# EAGLE design ESP32S2 STICK (EAGLE 9.6.2)
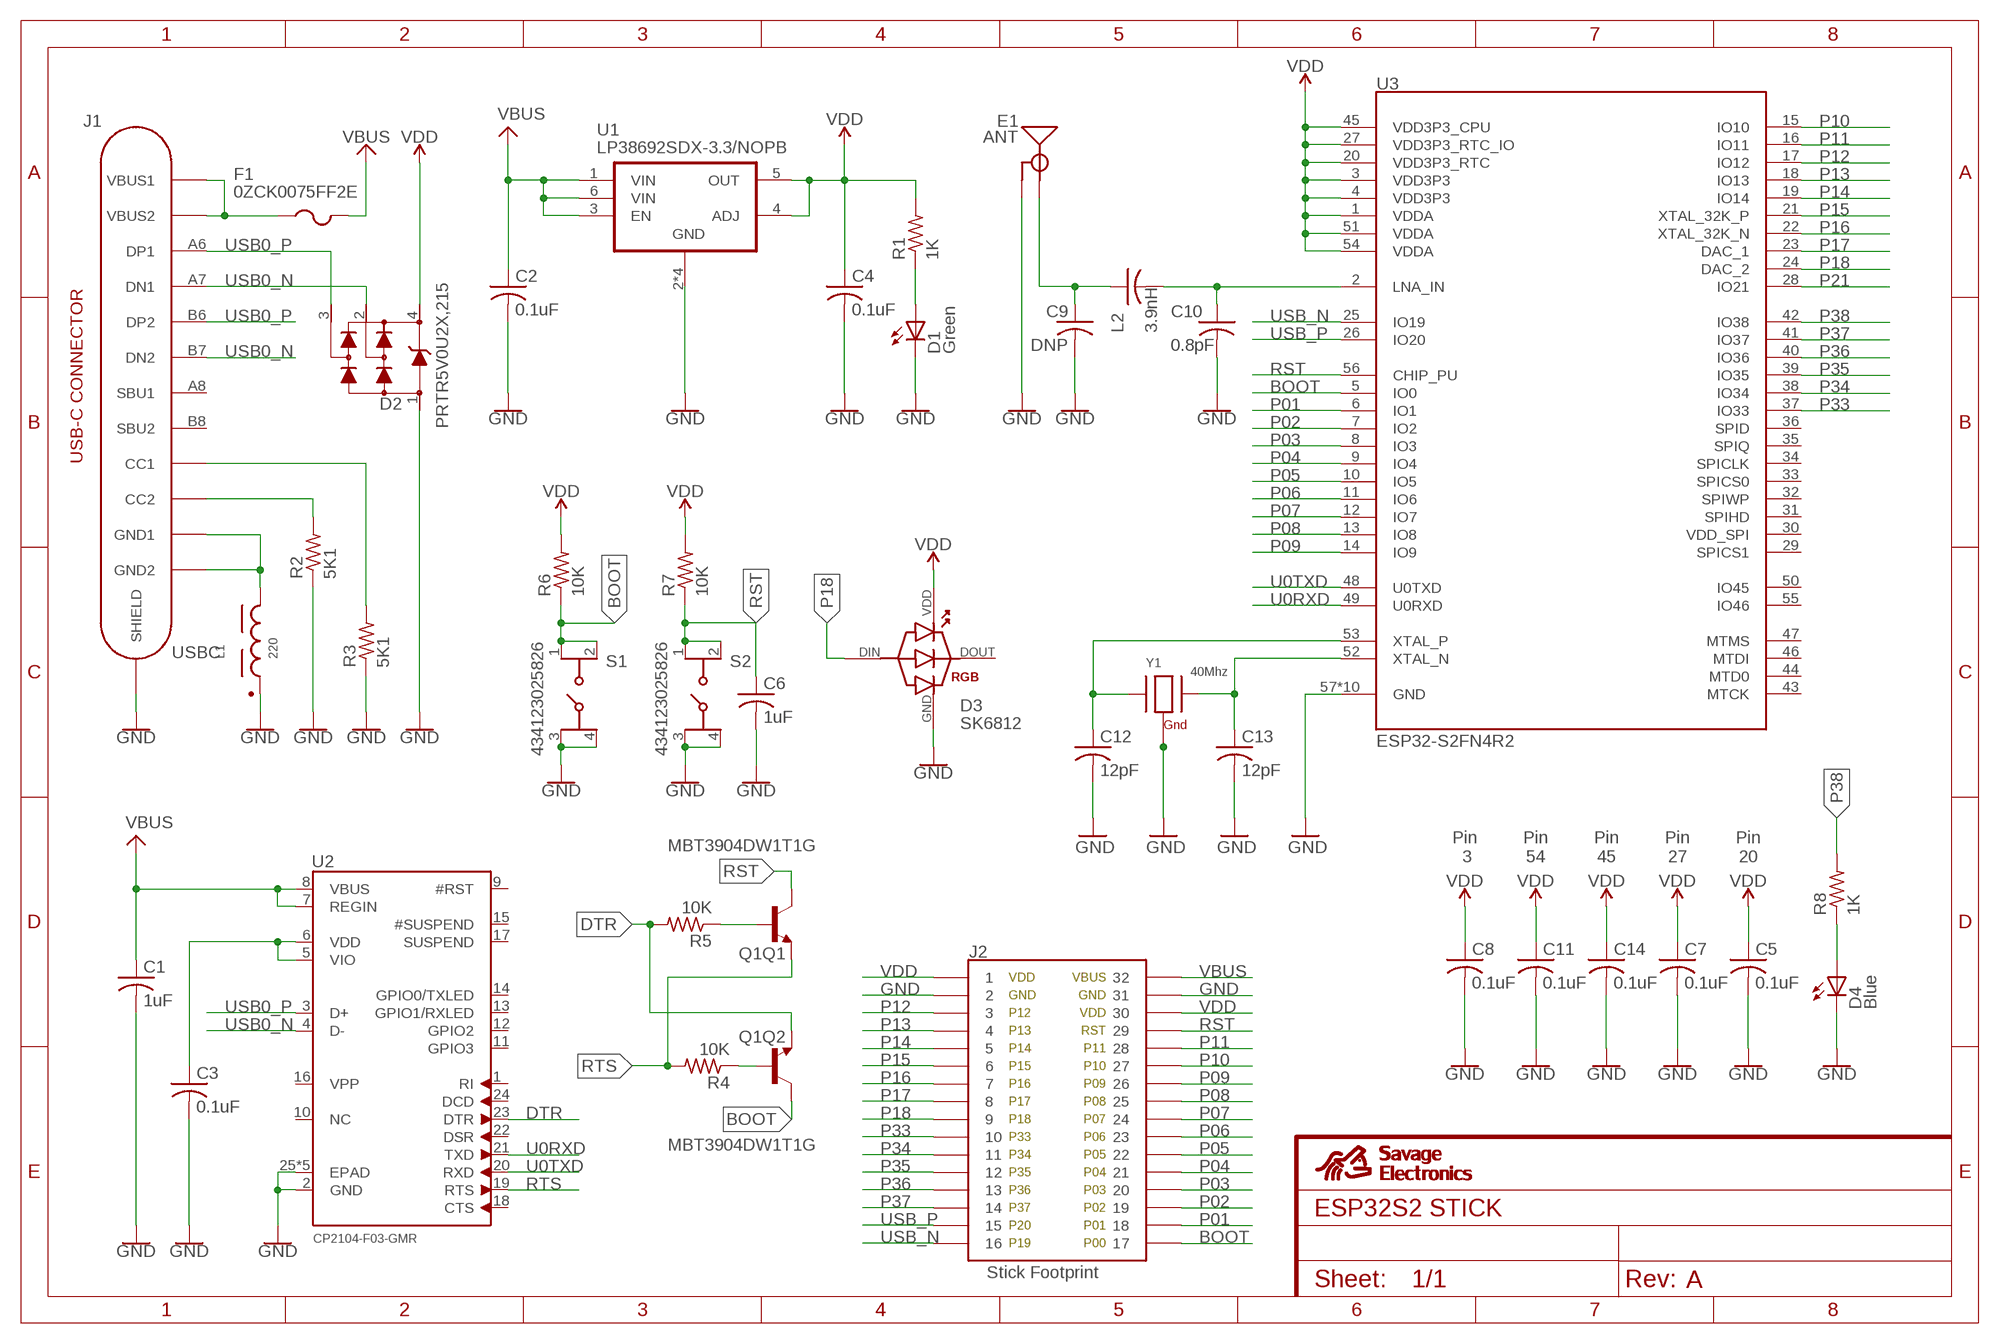
[diagram p0: schematic, sheet 1]

## Parts
C1  1uF  C-USC0603  [C0603]
C2  0.1uF  C-USC0603  [C0603]
C3  0.1uF  C-USC0603  [C0603]
C4  0.1uF  C-USC0603  [C0603]
C5  0.1uF  C-USC0603  [C0603]
C6  1uF  C-USC0603  [C0603]
C7  0.1uF  C-USC0603  [C0603]
C8  0.1uF  C-USC0603  [C0603]
C9  DNP  C-USC0402  [C0402]
C10  0.8pF  C-USC0402  [C0402]
C11  0.1uF  C-USC0603  [C0603]
C12  12pF  C-USC0402  [C0402]
C13  12pF  C-USC0402  [C0402]
C14  0.1uF  C-USC0603  [C0603]
D1  Green  LEDCHIP-LED0603  [CHIP-LED0603]
D2  PRTR5V0U2X,215  [SOT143B]
D3  SK6812  [20X20]
D4  Blue  LEDCHIP-LED0603  [CHIP-LED0603]
E1  ANT  ANTENNA-GROUNDEDTRACE-15.2MM  [TRACE_ANTENNA_2.4GHZ_15.2MM]
F1  0ZCK0075FF2E  PTCFUSE  [R0603F]
J1  USBC  [USBC]
J2  Stick Footprint  NRF52832PRO  [NRF52832_CASTELLATED]
L1  220  WE-CBA_0603_782631182_WB/HS  [WE-CBA_0603(W=2.2)]
L2  3.9nH  C-USC0402  [C0402]
Q1  MBT3904DW1T1G  TRANS_NPN_DUAL-MBT3904DW1T1  [SC70-6]
R1  1K  R-US_R0402  [R0402]
R2  5K1  R-US_R0402  [R0402]
R3  5K1  R-US_R0402  [R0402]
R4  10K  R-US_R0402  [R0402]
R5  10K  R-US_R0402  [R0402]
R6  10K  R-US_R0402  [R0402]
R7  10K  R-US_R0402  [R0402]
R8  1K  R-US_R0402  [R0402]
S1  434123025826  [434123025826]
S2  434123025826  [434123025826]
U1  LP38692SDX-3.3/NOPB  [LLP6-3X3]
U2  CP2102N-A02-GQFN24R  CP2104  [QFN24_4MM_SMSC]
U3  ESP32-S2FN4R2  ESP32-S2QFN54  [QFN40P700X700X90-57T400N]
Y1  40Mhz  XTAL-4  [NX2016]

## Nets
BOOT: J2.17AA J2.17BB J2.17CC J2.P17DD Q1.6(Q2:C) R6.1 S1.1 S1.2 U3.5(IO0)
DTR: Q1.1(Q2:E) R5.2 U2.23(DTR)
GND: C1.2 C2.2 C3.2 C4.2 C5.2 C6.2 C7.2 C8.2 C9.2 C10.2 C11.2 C12.2 C13.2 C14.2 D1.C D2.1 D3.3(GND) D4.C E1.GND J1.S1(SHIELD) J1.S2(SHIELD) J1.S3(SHIELD) J1.S4(SHIELD) J2.2 J2.2B J2.2C J2.29 J2.29B J2.29C J2.P2 J2.P29 L1.1 R2.1 R3.1 S1.3 S1.4 S2.3 S2.4 U1.2(GND) U1.P$1(GND) U1.P$2(GND) U1.P$3(GND) U2.2(GND) U2.25(EPAD) U2.P$1(EPAD) U2.P$2(EPAD) U2.P$3(EPAD) U2.P$4(EPAD) U3.57(GND) U3.P$1(GND) U3.P$2(GND) U3.P$3(GND) U3.P$4(GND) U3.P$5(GND) U3.P$6(GND) U3.P$7(GND) U3.P$8(GND) U3.P$9(GND) Y1.2(G2) Y1.4(G1)
N$1: J1.A1B12(GND1) J1.B1A12(GND2) L1.2
N$2: D4.A R8.1
N$3: J1.B5(CC2) R2.2
N$4: J1.A5(CC1) R3.2
N$6: Q1.5(Q1:B) R5.1
N$7: C10.1 L2.2 U3.2(LNA_IN)
N$8: Q1.2(Q2:B) R4.1
N$14: C12.1 U3.53(XTAL_P) Y1.1(X1)
N$15: C13.1 U3.52(XTAL_N) Y1.3(X2)
N$42: D1.A R1.1
N$45: C9.1 E1.ANT(SIGNAL) L2.1
N$47: C3.1 U2.5(VIO) U2.6(VDD)
P01: J2.16 J2.16B J2.16C J2.P16 U3.6(IO1)
P02: J2.17 J2.17B J2.17C J2.P17 U3.7(IO2)
P03: J2.18 J2.18B J2.18C J2.P18 U3.8(IO3)
P04: J2.19 J2.19B J2.19C J2.P19 U3.9(IO4)
P05: J2.20 J2.20B J2.20C J2.P20 U3.10(IO5)
P06: J2.21 J2.21B J2.21C J2.P21 U3.11(IO6)
P07: J2.22 J2.22B J2.22C J2.P22 U3.12(IO7)
P08: J2.23 J2.23B J2.23C J2.P23 U3.13(IO8)
P09: J2.24 J2.24B J2.24C J2.P24 U3.14(IO9)
P10: J2.25 J2.25B J2.25C J2.P25 U3.15(IO10)
P11: J2.26 J2.26B J2.26C J2.P26 U3.16(IO11)
P12: J2.3 J2.3B J2.3C J2.P3 U3.17(IO12)
P13: J2.4 J2.4B J2.4C J2.P4 U3.18(IO13)
P14: J2.5 J2.5B J2.5C J2.P5 U3.19(IO14)
P15: J2.6 J2.6B J2.6C J2.P6 U3.21(XTAL_32K_P)
P16: J2.7 J2.7B J2.7C J2.P7 U3.22(XTAL_32K_N)
P17: J2.8 J2.8B J2.8C J2.P8 U3.23(DAC_1)
P18: D3.4(DIN) J2.9 J2.9B J2.9C J2.P9 U3.24(DAC_2)
P21: U3.28(IO21)
P33: J2.10 J2.10B J2.10C J2.P10 U3.37(IO33)
P34: J2.11 J2.11B J2.11C J2.P11 U3.38(IO34)
P35: J2.12 J2.12B J2.12C J2.P12 U3.39(IO35)
P36: J2.13 J2.13B J2.13C J2.P13 U3.40(IO36)
P37: J2.14 J2.14B J2.14C J2.P14 U3.41(IO37)
P38: R8.2 U3.42(IO38)
RST: C6.1 J2.27 J2.27B J2.27C J2.P27 Q1.3(Q1:C) R7.1 S2.1 S2.2 U3.56(CHIP_PU)
RTS: Q1.4(Q1:E) R4.2 U2.19(RTS)
U0RXD: U2.21(TXD) U3.49(U0RXD)
U0TXD: U2.20(RXD) U3.48(U0TXD)
USB0_N: D2.2 J1.A7(DN1) J1.B7(DN2) U2.4(D-)
USB0_P: D2.3 J1.A6(DP1) J1.B6(DP2) U2.3(D+)
USB_N: J2.16AA J2.16BB J2.16CC J2.P16A U3.25(IO19)
USB_P: J2.15 J2.15B J2.15C J2.P15 U3.26(IO20)
VBUS: C1.1 C2.1 F1.2 J2.30 J2.30B J2.30C J2.P30 U1.1(VIN) U1.3(EN) U1.6(VIN) U2.7(REGIN) U2.8(VBUS)
VCC: F1.1 J1.A4B9(VBUS1) J1.B4A9(VBUS2)
VDD: C4.1 C5.1 C7.1 C8.1 C11.1 C14.1 D2.4 D3.1(VDD) J2.1 J2.1B J2.1C J2.28 J2.28B J2.28C J2.P1 J2.P28 R1.2 R6.2 R7.2 U1.4(ADJ) U1.5(OUT) U3.1(VDDA) U3.3(VDD3P3) U3.4(VDD3P3) U3.20(VDD3P3_RTC) U3.27(VDD3P3_RTC_IO) U3.45(VDD3P3_CPU) U3.51(VDDA) U3.54(VDDA)
Unconnected: D3.2(DOUT) J1.A8(SBU1) J1.B8(SBU2) U2.1(RI) U2.9(#RST) U2.10(NC) U2.11(GPIO3) U2.12(GPIO2) U2.13(GPIO1/RXLED) U2.14(GPIO0/TXLED) U2.15(#SUSPEND) U2.16(VPP) U2.17(SUSPEND) U2.18(CTS) U2.22(DSR) U2.24(DCD) U3.29(SPICS1) U3.31(SPIHD) U3.32(SPIWP) U3.33(SPICS0) U3.34(SPICLK) U3.35(SPIQ) U3.36(SPID) U3.43(MTCK) U3.44(MTD0) U3.46(MTDI) U3.47(MTMS) U3.50(IO45) U3.55(IO46)

## Notes on the sheet
- Pin
   3
- Pin
  54
- Pin
  45
- Pin
  27
- Pin
  20

## Power pins joined to a net without a drawn wire
VDD_SPI: U3.30(VDD_SPI)

## Library data of the parts
C1 = adafruit:C-US: CAPACITOR, American symbol
C2-C14 L2 = Adafruit:C-US: CAPACITOR, American symbol
D1 D4 = Adafruit:LED: LED OSRAM: - CHIPLED LG R971, LG N971, LY N971, LG Q971, LY Q971, LO R971, LY R971 LH N974, LH R974 LS Q976, LO Q976, LY Q976 LO Q996 - Hyper CHIPLED LW Q18S LB Q993, LB Q99A, LB R99A - SideLED LS A670, LO A670, LY A670, LG A670, LP A670 LB A673, LV A673, LT A673, LW A673 LH A674 LY A675 LS A676, LA A676, LO A676, LY A676, LW A676 LS A679, LY A679, LG A679 - Hyper Micro SIDELED® LS Y876, LA Y876, LO Y876, LY Y876 LT Y87S - SmartLED LW L88C, LW L88S LB L89C, LB L89S, LG L890 LS L89K, LO L89K, LY L89K LS L896, LA L896, LO L896, LY L896 - TOPLED LS T670, LO T670, LY T670, LG T670, LP T670 LSG T670, LSP T670, LSY T670, LOP T670, LYG T670 LG T671, LOG T671, LSG T671 LB T673, LV T673, LT T673, LW T673 LH T674 LS T676, LA T676, LO T676, LY T676, LB T676, LH T676, LSB T676, LW T676 LB T67C, LV T67C, LT T67C, LS T67K, LO T67K, LY T67K, LW E67C LS E67B, LA E67B, LO E67B, LY E67B, LB E67C, LV E67C, LT E67C LW T67C LS T679, LY T679, LG T679 LS T770, LO T770, LY T770, LG T770, LP T770 LB T773, LV T773, LT T773, LW T773 LH T774 LS E675, LA E675, LY E675, LS T675 LS T776, LA T776, LO T776, LY T776, LB T776 LHGB T686 LT T68C, LB T68C - Hyper Mini TOPLED® LB M676 - Mini TOPLED Santana® LG M470 LS M47K, LO M47K, LY M47K Source: http://www.osram.convergy.de/
D2 = SnapEDA Library:PRTR5V0U2X,215: Ultra low capacitance double rail-to-rail ESD protection diode
D3 = ledRGB:SK6812
E1 = SparkFun-RF:ANTENNA-GROUNDED: Antenna w/ Ground Connection 2.4GHz antennae with signal and ground terminals. TRACE_ANTENNA_2.4GHZ_15.2MM - Meander Trace antenna 15.2 x 5.7mm footprint Based on layout from TI app note AN043 <http://www.ti.com/lit/an/swra117d/swra117d.pdf>. TRACE_ANTENNA_2.4GHZ_25.7MM - Inverted F trace antenna 25.7 x 7.5 mm footprint. Based on layout from TI design note DN0007 <http://www.ti.com/lit/an/swru120b/swru120b.pdf>.
F1 = Adafruit:PTCFUSE: PTC fuses, resettable thermistors
J1 = USBC:USBC
J2 = NRF52832PRO Footprint:NRF52832PRO: Savage Electronics nRF52832 PRO footprint
L1 = EMCComponents (rev19b):WE-CBA_0603: WE-CBA SMD EMI Suppression Ferrite Bead Characteristics Reliable Ni-Sn electrodes High rated current up to 5A Recommended soldering: Reflow Operating temperature: -55°C to +125°C Applications * Perfect as data line filter and for uncoupling of distribution voltage *This special SMD chip bead ferrites can be put directly on the printed circuit board. They offer excellent anti-EMI properties and low DC-resistance. Placed very close next to the interference source even with smallest size 0402,maximal impedance at 1000 Ω can be reached. *High Speed: "High Speed " SMD ferrites WE-CBF have lower impedance in the lower frequency ranges thus they have only a low attenuation for fast signals. Application e.g. USB 2.0, IEEE 1394,LVDS *Wide Band: "Wide Band" SMD ferrites WE-CBF already show high impedance in low frequency range. Therefore they are wide band through the whole spectrum. Application e.g. control signats, RS232, RS422, DC/DC converter *High Current: "High Current " SMD ferrites WE-CBF are designed for high current (over 1 A). The rated current refers to 40K self-heating. High current SMD ferrites are available in all there types (High Speed, Wide Band and High Frequency). Application e.g. power supply, DC/DC converter *Advice: Pay attention for the use of SMD-Ferrites for high current>1A and ambient temperature over +85°C that the rated current has to be reduced when temperature is above +85°C (Derating). *At+100°C environment temperature the maximal rated current has to add up to only 60% of the data sheet value ,without an overload of the component. Variant abbreviation WB means WIDE BAND HS means HIGH SPEED HC means HIGH CURRENT <http://katalog.we-online.de/media/images/v2/Family_WE-CBA.jpg> Details see: http://katalog.we-online.de/en/pbs/WE-CBA/ Created: 2015-02-02 2015 (C) Wurth Elektronik
Q1 = SparkFun-DiscreteSemi:TRANS_NPN_DUAL: Dual NPN Transistors in Single Package The MBT3904W1 puts two general purpose 3904 NPN transistors in a single package. Datasheet <http://www.onsemi.com/pub_link/Collateral/MBT3904DW1T1-D.PDF> SparkFun Products: SparkFun ESP32 Thing <https://www.sparkfun.com/products/13907>; PROD_ID: TRANS-13337
R1-R8 = Adafruit:R-US_: RESISTOR, American symbol
S1 S2 = Eagle_SWITCHES (rev18c):434123025826: 4.2 x 3.2 mm J-Bend SMD Tact Switch WS-TASV MATERIAL PROPERTIES: Cover Material Stainless Steel Actuator Material LCP Actuator Flammability Rating UL94 V-0 Actuator Color White;​ Black Frame Material LCP Frame Flammability Rating UL94 V-0 Frame Color Black Contact Material Stainless Steel Contact Plating Silver Terminal Material Copper Alloy Terminal Plating Silver ELECTRICAL PROPERTIES: Rated Current [1] 50 mA Rated Voltage 16 V (DC) Contact Resistance Initial 500 mΩ Contact Resistance After Life Test 1 Ω Insulation Resistance 100 MΩ Withstanding Voltage 250 V (AC) Bounce 10 ms MECHANICAL PROPERTIES: Operation Force 260 g;​ 160 g Life Cycle 50000 Times;​ 100000 Times GENERAL INFORMATION: Operating Temperature -40 °C up to +85 °C Storage Temperature (in original packaging) -40 °C up to +85 °C PACKAGING PROPERTIES: Packaging Tape and Reel Packaging Unit (Qty.) 2900 <http://katalog.we-online.de/media/images/v2/Family_WS-TASV-4341x30258x6_Gruppe.jpg> Details see: http://katalog.we-online.de/em/datasheet/434123025826.pdf 2017(C) Wurth Elektronik
U1 = LP38692SDX-3.3_NOPB:LP38692SDX-3.3/NOPB: LDO REGULATOR 1A Adjustable Check prices <https://pricing.snapeda.com/parts/LP38692SDX-3.3/NOPB/Texas%20Instruments/view-part?ref=eda>; AVAILABILITY: In Stock; DESCRIPTION: 1-A, 10-V, low-dropout voltage regulator with enable 6-WSON -40 to 125; MF: Texas Instruments; MP: LP38692SDX-3.3/NOPB; PACKAGE: WSON-6 Texas Instruments; PRICE: None; PURCHASE-URL: https://pricing.snapeda.com/search/part/LP38692SDX-3.3/NOPB/?ref=eda
U2 = CP2104:CP2104: CP2104 - USB to UART Bridge VDD Output: 3.45V
U3 = SnapEDA Library:ESP32-S2; DESCRIPTION: WiFi Modules (802.11) SMD IC WiFi 56 Pin Single Core; MANUFACTURER_NAME: Espressif Systems; MANUFACTURER_PART_NUMBE: ESP32-S2; PACKAGE: QFN-56
Y1 = Adafruit:XTAL-4: Classic 4-pin 3.2 x 2.5mm crystal

## Board
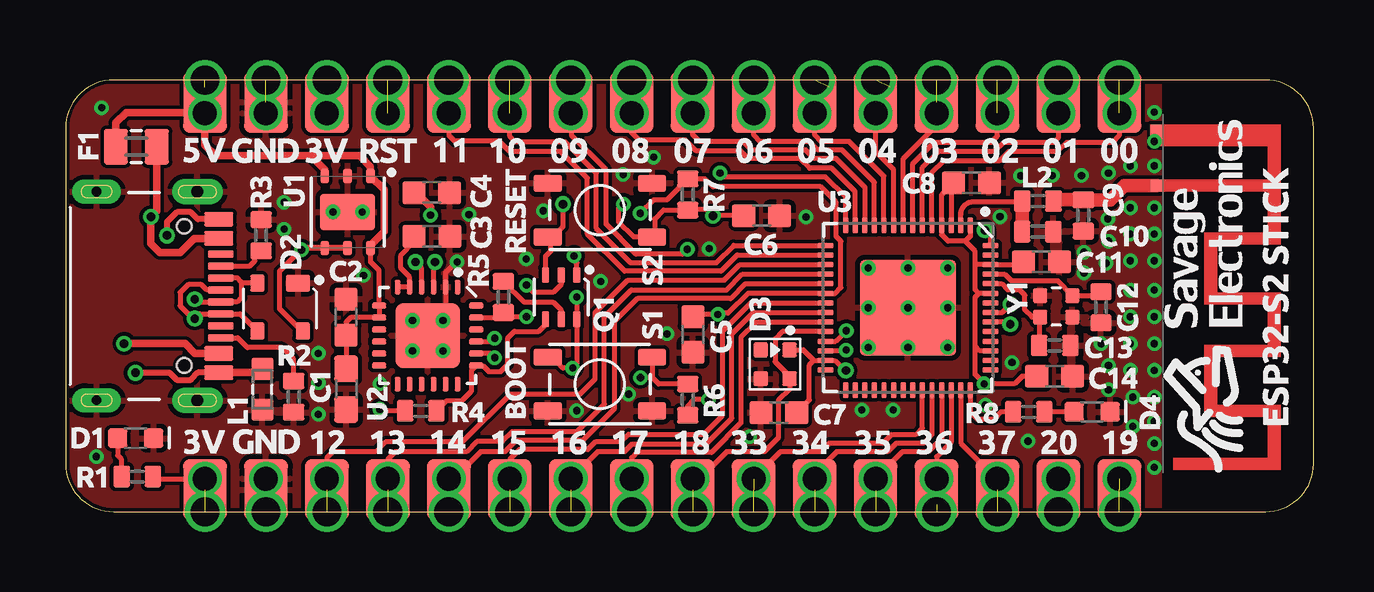
[diagram p1: board, top side]
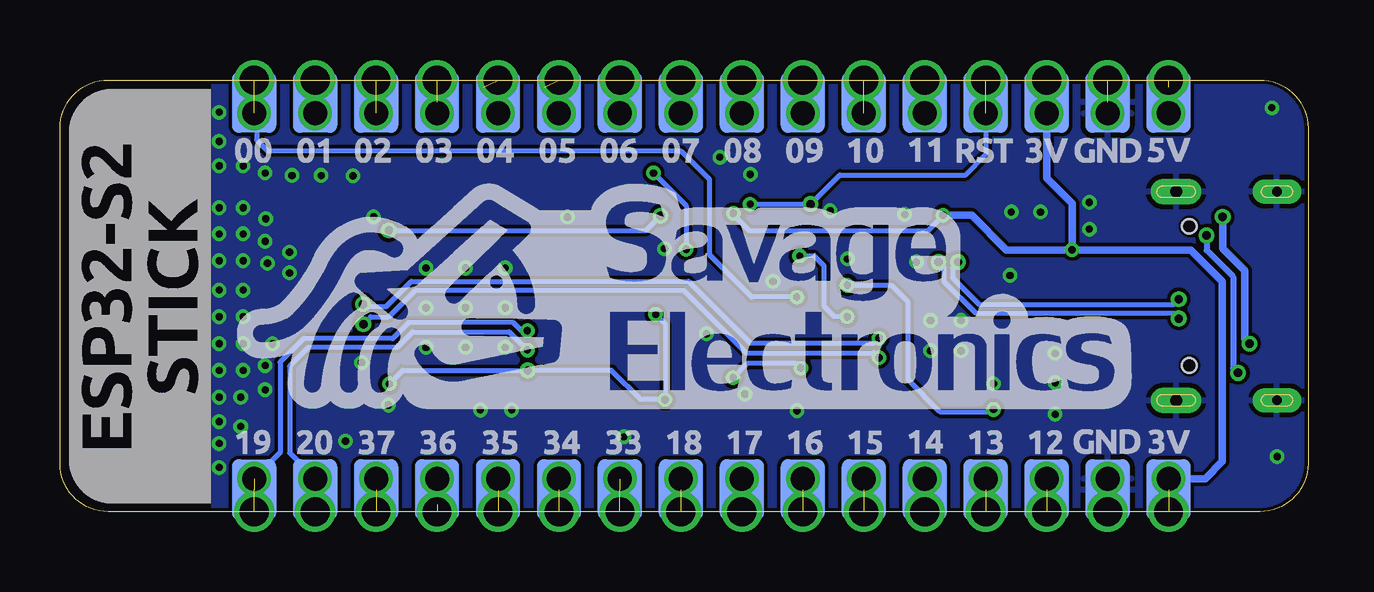
[diagram p2: board, bottom side, seen from below]

Size 52 x 18 mm. Coordinates in mm from the lower left corner, seen from the top.
Outline: 50,18 2,18 arc90 0,16 0,2 arc90 2,0 50,0 arc90 52,2 52,16 arc90 50,18
Copper layers (1*16): Top 0.035mm / dielectric 1.5mm / Bottom 0.035mm
Design rules "default *": minimum track width 6mil, minimum drill 0.3mm, track to track 6mil, track to pad 6mil, pad to pad 6mil, via to via 6mil, smd to smd 6mil, copper to edge 6mil, drill to drill 6mil, minimum pad ring 6mil, minimum via ring 6mil, stop-mask expansion 2mil, vias tented up to drill 20mil, thermal gap 8mil

### Footprints (pad centres in the part's own frame; a part is rotated, then mirrored left to right if it is on the bottom)
C0603 = smd 1.1 x 1: 1 -0.85,0; 2 0.85,0
C0603' = smd 0.965 x 0.965: 1 -0.748,0; 2 0.748,0
C0402 = smd 0.7 x 0.9: 1 -0.65,0; 2 0.65,0
CHIP-LED0603 = smd 0.8 x 0.8: A 0,-0.75; C 0,0.75
SOT143B = smd 1 x 0.7: 1 -0.75,-1 | smd 0.6 x 0.7: 2 0.95,-1; 3 0.95,1; 4 -0.95,1
20X20 = smd 0.61 x 0.61: 1 0.6,-0.6; 2 0.6,0.6; 3 -0.6,0.6; 4 -0.6,-0.6
TRACE_ANTENNA_2.4GHZ_15.2MM = smd 0.5 x 0.5: ANT 0,-0.25 | smd 0.9 x 0.5: GND -2.1,-0.25
R0603F = smd 1 x 1.473: 1 -0.85,0; 2 0.85,0
USBC = smd 0.61 x 1.219: A1B12 -3.2,3.744; A4B9 -2.4,3.744; B1A12 3.2,3.744; B4A9 2.4,3.744 | smd 0.305 x 1.067: A5 -1.25,3.82; A6 -0.25,3.82; A7 0.25,3.82; A8 1.25,3.82; B5 1.75,3.82; B6 0.75,3.82; B7 -0.75,3.82; B8 -1.75,3.82 | drill 0.5 pad 1.067 long: S1 -4.35,2.85; S2 4.35,2.85 | drill 0.4 pad 1.016 long: S3 -4.35,-1.35; S4 4.35,-1.35 | hole 0.6: -2.9,2.3; 2.9,2.3
NRF52832_CASTELLATED = smd 1.829 x 2.54: 1 3.81,0.923; 2 6.35,0.923; 3 8.89,0.923; 4 11.43,0.923; 5 13.97,0.923; 6 16.51,0.923; 7 19.05,0.923; 8 21.59,0.923; 9 24.13,0.923; 10 26.67,0.923; 11 29.21,0.923; 12 31.75,0.923; 13 34.29,0.923; 14 36.83,0.923; 15 39.37,0.923; 16 39.37,17.077; 16AA 41.91,0.923; 17 36.83,17.077; 17AA 41.91,17.077; 18 34.29,17.077; 19 31.75,17.077; 20 29.21,17.077; 21 26.67,17.077; 22 24.13,17.077; 23 21.59,17.077; 24 19.05,17.077; 25 16.51,17.077; 26 13.97,17.077; 27 11.43,17.077; 28 8.89,17.077; 29 6.35,17.077; 30 3.81,17.077 | smd 1.829 x 2.54 bottom: 1B 3.81,0.923; 2B 6.35,0.923; 3B 8.89,0.923; 4B 11.43,0.923; 5B 13.97,0.923; 6B 16.51,0.923; 7B 19.05,0.923; 8B 21.59,0.923; 9B 24.13,0.923; 10B 26.67,0.923; 11B 29.21,0.923; 12B 31.75,0.923; 13B 34.29,0.923; 14B 36.83,0.923; 15B 39.37,0.923; 16B 39.37,17.077; 16BB 41.91,0.923; 17B 36.83,17.077; 17BB 41.91,17.077; 18B 34.29,17.077; 19B 31.75,17.077; 20B 29.21,17.077; 21B 26.67,17.077; 22B 24.13,17.077; 23B 21.59,17.077; 24B 19.05,17.077; 25B 16.51,17.077; 26B 13.97,17.077; 27B 11.43,17.077; 28B 8.89,17.077; 29B 6.35,17.077; 30B 3.81,17.077 | drill 1.2: 1C 3.81,0; 2C 6.35,0; 3C 8.89,0; 4C 11.43,0; 5C 13.97,0; 6C 16.51,0; 7C 19.05,0; 8C 21.59,0; 9C 24.13,0; 10C 26.67,0; 11C 29.21,0; 12C 31.75,0; 13C 34.29,0; 14C 36.83,0; 15C 39.37,0; 16C 39.37,18; 16CC 41.91,0; 17C 36.83,18; 17CC 41.91,18; 18C 34.29,18; 19C 31.75,18; 20C 29.21,18; 21C 26.67,18; 22C 24.13,18; 23C 21.59,18; 24C 19.05,18; 25C 16.51,18; 26C 13.97,18; 27C 11.43,18; 28C 8.89,18; 29C 6.35,18; 30C 3.81,18 | drill 1: P1 3.81,1.38; P2 6.35,1.38; P3 8.89,1.38; P4 11.43,1.38; P5 13.97,1.38; P6 16.51,1.38; P7 19.05,1.38; P8 21.59,1.38; P9 24.13,1.38; P10 26.67,1.38; P11 29.21,1.38; P12 31.75,1.38; P13 34.29,1.38; P14 36.83,1.38; P15 39.37,1.38; P16 39.37,16.62; P16A 41.91,1.38; P17 36.83,16.62; P17DD 41.91,16.62; P18 34.29,16.62; P19 31.75,16.62; P20 29.21,16.62; P21 26.67,16.62; P22 24.13,16.62; P23 21.59,16.62; P24 19.05,16.62; P25 16.51,16.62; P26 13.97,16.62; P27 11.43,16.62; P28 8.89,16.62; P29 6.35,16.62; P30 3.81,16.62
WE-CBA_0603(W=2.2) = smd 0.914 x 0.914: 1 -0.852,0; 2 0.852,0
SC70-6 = smd 0.3 x 0.66: 1 -0.65,-0.92; 2 0,-0.92; 3 0.65,-0.92; 4 0.65,0.92; 5 0,0.92; 6 -0.65,0.92
R0402 = smd 0.7 x 0.9: 1 -0.65,0; 2 0.65,0
434123025826 = smd 1.168 x 0.711: 1 -2.175,1.121; 2 2.175,1.121; 3 -2.175,-1.121; 4 2.175,-1.121
LLP6-3X3 = smd 0.356 x 0.61: 1 -0.95,-1.502; 2 0,-1.502; 3 0.95,-1.502; 4 0.95,1.502; 5 0,1.502; 6 -0.95,1.502 | smd 2.286 x 1.524: P$1 0,0 | drill 0.3: P$2 -0.61,0; P$3 0.61,0
QFN24_4MM_SMSC = smd 0.61 x 0.25: 1 -2.024,1.25; 2 -2.024,0.75; 3 -2.024,0.25; 4 -2.024,-0.25; 5 -2.024,-0.75; 6 -2.024,-1.25; 13 2.024,-1.25; 14 2.024,-0.75; 15 2.024,-0.25; 16 2.024,0.25; 17 2.024,0.75; 18 2.024,1.25 | smd 0.25 x 0.61: 7 -1.25,-2.024; 8 -0.75,-2.024; 9 -0.25,-2.024; 10 0.25,-2.024; 11 0.75,-2.024; 12 1.25,-2.024; 19 1.25,2.024; 20 0.75,2.024; 21 0.25,2.024; 22 -0.25,2.024; 23 -0.75,2.024; 24 -1.25,2.024 | smd 2.7 x 2.7: 25 0,0 | drill 0.3: P$1 -0.635,0.635; P$2 -0.635,-0.635; P$3 0.635,-0.635; P$4 0.635,0.635
QFN40P700X700X90-57T400N = smd 0.66 x 0.22: 1 -3.445,2.6; 2 -3.445,2.2; 3 -3.445,1.8; 4 -3.445,1.4; 5 -3.445,1; 6 -3.445,0.6; 7 -3.445,0.2; 8 -3.445,-0.2; 9 -3.445,-0.6; 10 -3.445,-1; 11 -3.445,-1.4; 12 -3.445,-1.8; 13 -3.445,-2.2; 14 -3.445,-2.6; 29 3.445,-2.6; 30 3.445,-2.2; 31 3.445,-1.8; 32 3.445,-1.4; 33 3.445,-1; 34 3.445,-0.6; 35 3.445,-0.2; 36 3.445,0.2; 37 3.445,0.6; 38 3.445,1; 39 3.445,1.4; 40 3.445,1.8; 41 3.445,2.2; 42 3.445,2.6 | smd 0.22 x 0.66: 15 -2.6,-3.445; 16 -2.2,-3.445; 17 -1.8,-3.445; 18 -1.4,-3.445; 19 -1,-3.445; 20 -0.6,-3.445; 21 -0.2,-3.445; 22 0.2,-3.445; 23 0.6,-3.445; 24 1,-3.445; 25 1.4,-3.445; 26 1.8,-3.445; 27 2.2,-3.445; 28 2.6,-3.445; 43 2.6,3.445; 44 2.2,3.445; 45 1.8,3.445; 46 1.4,3.445; 47 1,3.445; 48 0.6,3.445; 49 0.2,3.445; 50 -0.2,3.445; 51 -0.6,3.445; 52 -1,3.445; 53 -1.4,3.445; 54 -1.8,3.445; 55 -2.2,3.445; 56 -2.6,3.445 | smd 4 x 4: 57 0,0 | drill 0.3 pad 0.61: P$1 -1.652,-1.652; P$2 1.652,-1.652; P$3 0,-1.652; P$4 0,0; P$5 0,1.652; P$6 1.652,1.652; P$7 1.652,0; P$8 -1.652,0; P$9 -1.652,1.652
NX2016 = smd 0.6 x 0.6: 1 -0.624,-0.449; 2 0.724,-0.449; 3 0.724,0.449; 4 -0.624,0.449

### Placement (x,y rotation side)
C1  11.69,5.11 270 top
C2  0.1uF  [C0603']  11.69,8.11 90 top
C3  0.1uF  [C0603']  15.27,11.48 0 top
C4  0.1uF  [C0603']  15.26,13.31 0 top
C5  0.1uF  [C0603']  26.14,7.39 270 top
C6  1uF  [C0603']  29.01,12.34 0 top
C7  0.1uF  [C0603']  29.72,4.14 180 top
C8  0.1uF  [C0603']  37.75,13.72 0 top
C9  42.41,12.36 270 top
C10  40.51,11.68 0 top
C11  0.1uF  [C0603']  40.66,10.42 0 top
C12  43.14,8.53 270 top
C13  41.22,6.93 0 top
C14  0.1uF  [C0603']  41.22,5.65 0 top
D1  2.92,3.07 270 top
D2  8.94,8.53 180 top
D3  29.57,6.15 90 top
D4  42.77,4.17 270 top
E1  45.71,13.6 270 top
F1  2.95,15.22 180 top
J1  2.64,9 270 top
J2  2,0 0 top
L1  8.2,5.1 90 top
L2  40.51,12.95 180 top
Q1  20.65,8.95 180 top
R1  2.99,1.47 0 top
R2  9.51,4.8 90 top
R3  8.15,11.53 270 top
R4  14.8,4.21 0 top
R5  18.24,8.96 270 top
R6  25.93,4.67 270 top
R7  25.93,13.23 90 top
R8  40.13,4.17 180 top
S1  22.26,5.32 0 top
S2  22.26,12.58 180 top
U1  11.75,12.5 180 top
U2  15.09,7.34 270 top
U3  35.1,8.51 270 top
Y1  41.33,8.56 180 top

### Tracks (layer width: path | path; a pad name or v marks a point on that pad's centre or on a via)
BOOT  (via drill 0.3)  (3 unrouted)
  Top 0.203: R6.1 24.71,5.33 24.44,5.59 S1.2 24.44,5.59 v23.95,5.59 | U3.5 36.1,14.16 36.59,14.65 38.93,14.65 39.32,15.04 41.35,15.04 41.72,15.4 43.6,15.4 43.91,15.71 J2.P17DD | S1.1 20.09,6.2 20.52,6.2 20.73,5.99 v21.13,5.99 21.11,6.01 21.3,6.2 Q1.6 v21.3,8.95
  Bottom 0.203: J2.P17DD 43.81,16.52 43.81,15.5 43.34,15.04 26.11,15.04 24.94,13.87 24.94,10.72 23.18,8.95 v21.3,8.95 | v23.95,5.59 23.34,6.2 21.34,6.2 v21.13,5.99
DTR  (via drill 0.3)
  Top 0.203: U2.23 18.03,8.09 R5.2 18.42,8.13 v19.2,8.13 | v21.18,10.67 21.18,10.5 21.3,10.38 Q1.1
  Bottom 0.203: v19.2,8.13 19.71,8.13 20.17,8.59 20.17,10.26 20.57,10.67 v21.18,10.67
GND  (via drill 0.3)  (1 unrouted)
  Top 0.203: U2.25 15.84,8.09 U2.2 15.84,9.98 16.28,10.42 v16.32,10.42
  other vias: 44.37,7.01 44.37,5.89 44.47,4.78 44.47,3.56 44.37,8.13 44.37,9.25 44.37,10.46 44.37,11.58 44.37,12.67 44.37,14.43 22.29,9.6 16.81,12.4 10.53,5.38 10.53,4.06 12.41,9.86 10.53,6.6 13.11,5.34 23.46,4.9 9.11,12.9 1.5,16.85 21.29,4.21 1.28,2.3 23.23,14.07 43.45,14.12 42.34,14.02 41.12,14.02 39.8,14.01 42.44,10.82 43.43,12.22 43.45,11.28 43.15,7.01 43.35,10.36 43.45,6.09 43.45,5.08 42.44,9.96 25.06,7.42 19.91,12.55 26.82,10.97 30.85,12.29 24.5,14.78 19.2,10.54 38.93,12.31 34.49,4.24 33.18,4.24 39.44,6.22 9.11,11.79 45.37,15.44 45.37,14.43 45.37,16.66 45.37,12.67 45.37,11.58 45.37,10.46 45.37,9.25 45.37,8.13 45.37,7.01 45.37,5.89 45.37,4.78 45.37,3.76 45.37,2.84 45.37,1.84 38.32,4.45 40.1,2.95 28.51,3.12
  pour Top: 0,16 0,2 arc90 2,0 45.6,0 45.6,18 2,18 arc90
  pour Bottom: 0,16 0,2 arc90 2,0 45.6,0 45.6,18 2,18 arc90
N$1  (via drill 0.35)
  Top 0.254: J1.A1B12 5.51,12.2 5.22,12.49 4.63,12.49 4.22,12.08 v4.22,11.52 | v2.91,5.79 4.34,5.79 4.62,5.5 5.22,5.5 5.52,5.8 J1.B1A12
  Top 0.305: L1.2 8.05,5.8 J1.B1A12
  Bottom 0.254: v4.22,11.52 4.22,10.91 3.12,9.8 3.12,5.99 v2.91,5.79
N$2
  Top 0.203: D4.A R8.1
N$3
  Top 0.203: R2.2 9.51,6.37 9.03,6.84 7.58,6.84 7.17,7.25 J1.B5
N$4
  Top 0.203: J1.A5 7.68,10.25 7.89,10.46 7.89,10.88 R3.2
N$6
  Top 0.203: Q1.5 20.65,8.4 20.32,8.74 19.11,8.74 R5.1
N$7
  Top 0.203: U3.2 37.3,12.4 arc-45 37.45,12.77 arc-45 37.84,12.93 39.84,12.93 L2.2
  Top 0.559: C10.1 L2.2
N$8  (via drill 0.3)
  Top 0.203: R4.1 13.16,4.21 v13.1,4.27 | Q1.2 20.65,9.48 20.32,9.14 19.51,9.14 v19.2,9.45
  Bottom 0.203: v13.1,4.27 13.21,4.17 15.34,4.17 16.66,5.49 16.66,8.74 17.37,9.45 v19.2,9.45
N$14
  Top 0.203: U3.53 39.13,9.91 39.4,9.64 41.34,9.64 41.95,9.03 Y1.1 42.98,9.01 C12.1
N$15
  Top 0.203: U3.52 39,9.51 39.26,9.26 39.75,9.26 39.98,9.03 39.98,8.41 40.27,8.11 Y1.3 40.57,8.08 C13.1
N$42
  Top 0.203: D1.A 2.17,2.35 2.34,2.18 R1.1
N$45
  Top 0.559: E1.ANT 44.12,13.6 43.52,13.01 C9.1 arc-45 42.4,13.01 41.22,13.01 L2.1
N$47
  Top 0.203: U2.6 U2.5 14.34,9.78 13.97,10.15 13.97,10.69 14.52,11.24 C3.1
P01
  Top 0.203: U3.6 35.7,14.37 36.37,15.04 38.72,15.04 39.08,15.4 41.17,15.4 41.37,15.6 J2.P16 41.6,16.85 J2.16B
P02  (3 unrouted)
  Top 0.152: J2.P17
  Top 0.203: U3.7 35.3,14.52 36.19,15.41 38.57,15.41 38.83,15.66 J2.P17 39.29,17.08
P03  (2 unrouted)
  Top 0.203: J2.18B 36.52,16.85 J2.P18 36.29,16.11 34.9,14.72 U3.8
P04  (2 unrouted)
  Top 0.152: J2.19B 33.8,17.13
  Top 0.203: J2.P19 33.75,15.02 34.5,14.27 U3.9
  Top 0.305: J2.19B 34.37,17.7
  Bottom 0.152: J2.P19 33.98,16.85 J2.19B
P05  (2 unrouted)
  Top 0.203: U3.10 34.1,14.01 32.66,15.44 31.5,15.44 31.21,15.73 J2.P20
  Top 0.305: J2.P20 31.44,16.85 J2.20B 31.83,17.7
P06
  Top 0.203: U3.11 33.7,13.75 32.36,15.09 31.35,15.09 30.99,15.44 28.96,15.44 28.67,15.73 J2.P21
  Bottom 0.203: J2.21 28.9,16.85 J2.P21
P07
  Top 0.203: U3.12 33.32,11.97 33.32,13.53 32.11,14.73 31.2,14.73 30.85,15.09 28.6,15.09 28.25,15.44 26.42,15.44 26.13,15.73 J2.P22
  Bottom 0.203: J2.22 26.36,16.85 J2.P22
P08
  Top 0.203: U3.13 32.9,13.35 31.93,14.33 31.01,14.33 30.6,14.73 28.45,14.73 28.14,15.04 26.28,15.04 25.82,15.5 23.89,15.5 23.59,15.81 J2.P23
  Bottom 0.203: J2.23B 23.82,16.85 J2.P23
P09  (via drill 0.3)
  Top 0.203: v25.91,10.95 25.71,10.74 23.77,10.74 22.52,11.99 22.52,14.26 21.08,15.71 21.08,16.59 J2.P24 | U3.14 32.5,13.12 31.66,13.96 27.43,13.96 v27.27,14.12
  Bottom 0.203: v27.27,14.12 25.91,12.76 v25.91,10.95
P10  (3 unrouted)
  Top 0.203: U3.15 27.84,11.11 27.12,10.39 23.54,10.39 22.12,11.81 22.12,14.13 20.83,15.42 18.75,15.42 18.51,15.65 J2.P25
P11
  Top 0.203: U3.16 28,10.71 27.32,10.03 23.29,10.03 21.74,11.58 21.74,13.92 20.64,15.02 18.51,15.02 18.08,15.45 16.22,15.45 15.97,15.71 J2.P26
  Bottom 0.203: J2.26B 16.2,16.85 J2.P26
P12  (1 unrouted)
  Top 0.152: 10.94,1.33 J2.P3
  Top 0.203: U3.17 28.1,10.31 27.45,9.66 23.43,9.66 22.07,8.3 22.07,5.54 21.44,4.91 18.54,4.91 16.53,2.9 13.33,2.9 12.92,2.5 11.13,2.5 10.89,2.25 J2.P3
  Top 0.305: J2.3 10.89,1.28 10.94,1.33
  Bottom 0.152: J2.P3 J2.3
P13  (1 unrouted)
  Top 0.203: U3.18 28.2,9.91 27.55,9.25 23.58,9.25 22.45,8.13 22.45,4.49 21.3,3.34 18.61,3.34 18.2,2.93 17.14,2.93 16.71,2.5 13.73,2.5 13.43,2.19 J2.P4 J2.4B
  Bottom 0.152: J2.P4 J2.4B
P14
  Top 0.203: U3.19 28.33,9.51 27.71,8.89 23.82,8.89 22.87,7.93 22.87,4.29 21.56,2.98 18.79,2.98 18.31,2.5 17.29,2.5 16.17,1.38 J2.P5 J2.5B
  Bottom 0.203: J2.5B J2.P5 | J2.P5 15.97,1.97 16,2 16,1.41 J2.P5
P15  (1 unrouted)
  Top 0.152: 18.51,1.32 J2.6B J2.P6
  Top 0.203: U3.21 28.55,8.71 27.38,7.54 27.38,4.02 26.6,3.23 23.46,3.23 23.13,2.9 22.07,2.9 21.76,2.6 18.92,2.6 18.51,2.19 J2.P6 18.51,1.32
  Bottom 0.152: J2.P6 J2.6B
P16  (1 unrouted)
  Top 0.203: U3.22 28.65,8.31 27.76,7.42 27.76,3.89 26.7,2.83 23.61,2.83 23.29,2.5 22.17,2.5 J2.P7 J2.7B
  Bottom 0.152: J2.P7 J2.7B
P17
  Top 0.203: U3.23 28.77,7.91 28.14,7.28 28.14,3.7 26.92,2.47 23.81,2.47 23.59,2.25 J2.P8 23.59,1.32 J2.8
  Bottom 0.203: J2.8 J2.P8
P18  (1 unrouted)
  Top 0.152: J2.9 J2.P9
  Top 0.203: J2.9 26.03,1.02 26.03,1.28 J2.P9 26.43,1.38 27.54,2.5 29.12,2.5 29.71,3.09 29.71,4.65 30.17,5.11 D3.4 30.17,5.65 29.57,6.25 29.57,7.21 29.86,7.51 U3.24
  Bottom 0.152: 26.13,1.41 J2.P9 J2.9
P33  (3 unrouted)
  Top 0.203: U3.37 35.7,3.49 35.42,3.21 34.41,3.21 34.05,2.85 31.82,2.85 31.46,2.5 29.79,2.5 J2.P10
P34  (1 unrouted)
  Top 0.203: U3.38 36.1,3.21 35.74,2.85 34.61,2.85 34.26,2.5 32.12,2.5 31.21,1.58 J2.P11 J2.11B
  Bottom 0.152: J2.P11 31.16,1.33 31.16,0.97 J2.11B
P35  (1 unrouted)
  Top 0.152: J2.12 33.75,0.89
  Top 0.203: J2.12 J2.P12 34.87,2.5 35.94,2.5 36.5,3.06 U3.39
  Bottom 0.152: 33.75,0.87 J2.12 J2.P12
P36  (1 unrouted)
  Top 0.203: 36.29,1.32 J2.P13 36.29,2.29 36.9,2.91 U3.40
  Top 0.305: 36.29,0.3 J2.13B 36.29,1.32
  Bottom 0.152: J2.P13 J2.13B
P37  (1 unrouted)
  Top 0.152: J2.P14 38.83,1.33
  Top 0.203: U3.41 37.3,2.86 38.8,1.35 | 38.8,1.35 J2.P14 | J2.14 38.83,1.33 38.8,1.35
  Bottom 0.152: J2.P14 38.78,1.33 38.78,0.96 J2.14
P38
  Top 0.203: U3.42 37.7,4.16 38,3.86 38.67,3.86 38.97,4.17 R8.2
RST  (via drill 0.3, 0.35)  (3 unrouted)
  Top 0.203: v23.24,12.83 23.04,12.62 23.04,12.08 23.67,11.46 S2.1 24.54,11.56 24.54,12.21 24.91,12.58 R7.1 25.94,12.6 26.72,12.6 v26.98,12.34 C6.1 | U3.56 38.55,11.49 v38.3,11.73 | Q1.3 20,10.66 20.22,10.87 20.22,11.33 S2.2 20.29,11.46 20.73,11.89 v20.73,12.83
  Bottom 0.203: v23.24,12.83 v20.73,12.83 19.51,14.05 14.27,14.05 13.43,14.88 J2.P27 | v38.3,11.73 27.58,11.73 v26.98,12.34
RTS
  Top 0.203: R4.2 15.86,4.62 16.5,4.62 16.91,5.02 16.91,5.89 U2.19 17.38,6.09 17.63,5.84 18.14,5.84 18.43,6.14 18.43,7.25 18.7,7.52 19.71,7.52 20,7.81 Q1.4
U0RXD  (via drill 0.3, 0.35)
  Top 0.203: U3.49 39.03,8.31 v39.37,8.65 | U2.21 17.73,7.09 v17.88,7.24
  Bottom 0.203: v39.37,8.65 39.27,8.55 38.41,8.55 37.36,9.6 25.81,9.6 23.24,7.04 18.08,7.04 v17.88,7.24
U0TXD  (via drill 0.3, 0.35)
  Top 0.203: v39.36,7.82 39.27,7.91 U3.48 | v17.88,6.43 17.71,6.59 U2.20
  Bottom 0.203: v39.36,7.82 39.06,8.12 38.29,8.12 37.17,9.25 26.03,9.25 23.41,6.63 18.08,6.63 v17.88,6.43
USB0_N  (via drill 0.35)
  Top 0.203: v14.59,10.41 14.84,10.16 U2.4 | 7.33,9.53 7.33,9.59 7.17,9.75 J1.B7 | 7.33,9.53 7.33,8.93 7.15,8.75 J1.A7 5.5,8.75 v5.38,8.86 | D2.2 7.33,9.53
  Bottom 0.203: v14.59,10.41 14.81,10.19 14.81,9.75 13.69,8.64 5.61,8.64 v5.38,8.86
USB0_P  (via drill 0.35)
  Top 0.203: v15.39,10.41 15.34,10.36 U2.3 | J1.A6 5.89,9.25 5.66,9.47 5.11,9.47 4.78,9.14 4.78,8.59 5.31,8.05 v5.38,8.05 5.58,8.25 J1.B6 7.28,8.25 D2.3
  Bottom 0.203: v15.39,10.41 15.17,10.19 15.17,9.61 13.84,8.28 5.61,8.28 v5.38,8.05
USB_N  (via drill 0.3)  (3 unrouted)
  Top 0.203: v32.53,7.55 32.09,7.11 U3.25
  Bottom 0.203: v32.53,7.55 32.78,7.55 33.14,7.91 37.46,7.91 38.14,7.22 41.85,7.22 42.82,6.24 42.82,2.47 J2.P16A
USB_P  (via drill 0.3)
  Top 0.203: v32.53,6.74 32.49,6.71 U3.26
  Bottom 0.203: v32.53,6.74 33.29,7.5 37.3,7.5 37.95,6.86 41.66,6.86 42.44,6.08 42.44,2.45 J2.P15
VBUS  (1 unrouted)
  Top 0.203: C1.1 C2.1 11.7,7.9 11.88,8.09 U2.8 U2.7 13.07,10.07 12.7,10.43 U1.6
  Top 0.305: 5.81,16.66 5.8,16.65 2.53,16.65 2.1,16.22 F1.2 | 10.22,14.84 6.26,14.84 5.81,15.29 J2.30B 5.81,17.7 | 10.22,14.84 10.8,14.26 U1.3 | U1.6 12.7,11.11 13.28,11.68 13.28,13.42 U1.1 12.7,14.39 12.25,14.84 10.22,14.84
  Top 0.406: J2.30B 5.81,16.66 J2.P30
  Bottom 0.152: J2.30B J2.P30
VCC  (via drill 0.35)
  Top 0.305: J1.A4B9 5.37,11.4 4.78,10.8 3.93,10.8 3.56,11.18 v3.56,12.29 3.8,12.54 F1.1 | J1.B4A9 5.39,6.6 4.98,7.01 v2.44,7.01
  Bottom 0.305: v2.44,7.01 2.64,7.21 2.64,10.06 3.56,10.97 v3.56,12.29
VDD  (via drill 0.3, 0.35)  (1 unrouted)
  Top 0.203: J2.1 J2.P1 3.73,1.38 R1.2 | R6.2 25.93,4.42 26.18,4.67 v26.79,4.67 | v23.95,12.45 24.5,13.01 25.05,13.01 R7.2 26.64,13.88 26.97,13.55 31.46,13.55 32.11,12.9 32.11,11.48 32.31,11.28 32.31,9.35 32.07,9.11 U3.20 28.44,9.11 27.61,8.28 27.23,8.28 v27.18,8.23 26.23,8.23 C5.1 | C11.1 39.8,10.31 U3.54 37.95,10.31 37.9,10.36 | U3.51 38.05,9.11 | 38.05,9.11 37.9,9.26 37.9,10.36 | U3.3 36.9,13.61 C8.1 36.5,13.22 U3.4 36.5,11.55 36.78,11.28 37.49,11.28 | 37.9,10.36 37.9,10.87 37.49,11.28 | U3.45 38.1,6.71 37.9,6.91 | 37.9,6.91 37.9,8.95 38.05,9.11 | U3.1 37.7,11.49 37.49,11.28 | 37.9,6.91 37.9,5.72 38.28,5.34 v38.28,5.33 39.54,5.33 39.86,5.65 C14.1 | D2.4 9.84,7.53 8.91,8.46 8.91,10.03 9.8,10.92 v9.83,10.92 | v32.51,5.89 32.45,5.89 32.04,6.31 U3.27 31.18,6.31 | D3.1 30.74,6.75 31.18,6.31 | C7.1 30.99,4.66 30.99,6.11 31.18,6.31
  Top 0.254: U1.5 U1.4 9.9,10.99 v9.83,10.92
  Top 0.305: v15.21,12.37 15.21,12.71 14.61,13.31 C4.1
  Bottom 0.152: J2.P1 J2.1
  Bottom 0.203: v23.95,12.45 23.95,12.39 23.29,11.73 15.82,11.73 15.21,12.35 v15.21,12.37 | J2.28B J2.P28 | v27.18,8.23 26.79,7.84 v26.79,4.67 | 26.82,4.65 v26.79,4.67 | v38.28,5.33 37.72,5.89 v32.51,5.89 29.03,5.89 27.81,4.67 v26.79,4.67
  Bottom 0.305: J2.P1 4.29,1.38 3.58,2.09 3.58,9.6 4.9,10.92 v9.83,10.92 | v15.21,12.37 14.01,12.37 12.57,10.92 v9.83,10.92 | J2.P28 10.89,13.91 9.83,12.85 v9.83,10.92